# EAGLE schematic cigpack-main rc1a (EAGLE 4.13)
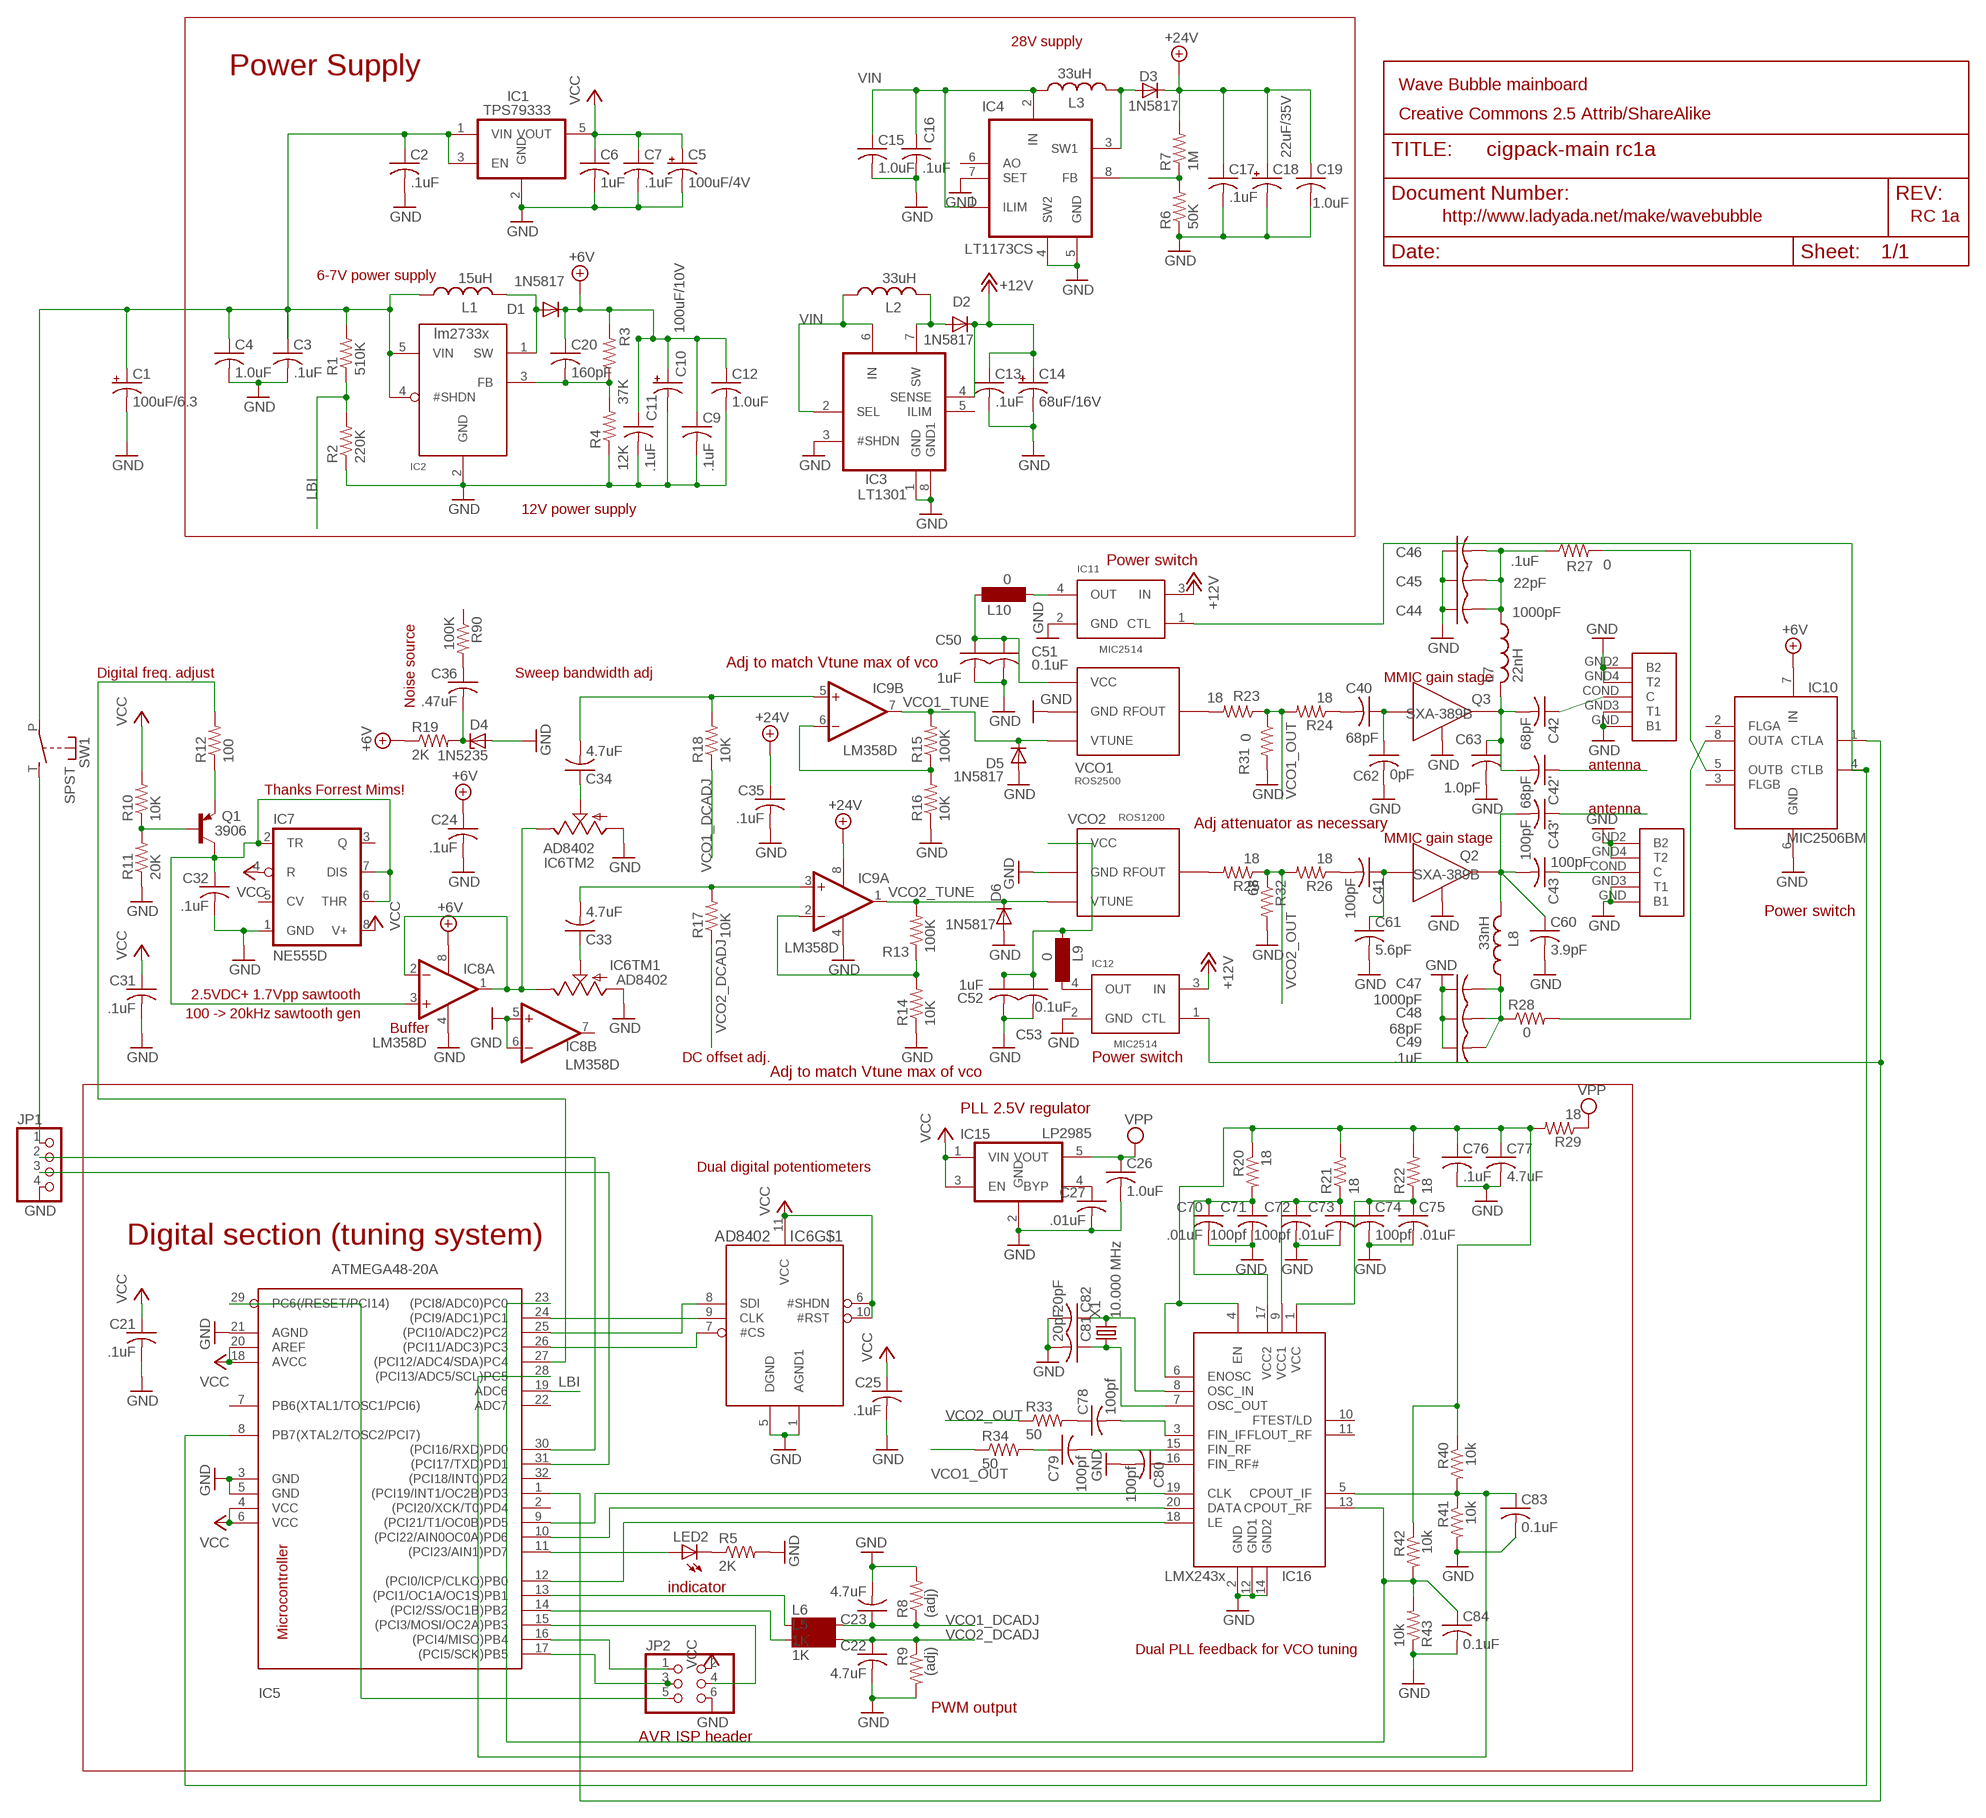
[diagram p0: schematic, sheet 1]

## Parts
C1  100uF/6.3  CPOL-USD  [PANASONIC_D]
C2  .1uF  C-USC1206  [C1206]
C3  .1uF  C-USC1206  [C1206]
C4  1.0uF  C-USC1206  [C1206]
C5  100uF/4V  CPOL-USD  [PANASONIC_D]
C6  1uF  C-USC1206  [C1206]
C7  .1uF  C-USC1206  [C1206]
C9  .1uF  C-USC1206  [C1206]
C10  100uF/10V  CPOL-USCT7343  [CT7343]
C11  .1uF  C-USC1206  [C1206]
C12  1.0uF  C-USC1206  [C1206]
C13  .1uF  C-USC1206  [C1206]
C14  68uF/16V  CPOL-USCT6032  [CT6032]
C15  1.0uF  C-USC1206  [C1206]
C16  .1uF  C-USC1206  [C1206]
C17  .1uF  C-USC1206  [C1206]
C18  22uF/35V  CPOL-USD/7343-31W  [D/7343-31W]
C19  1.0uF  C-USC1206  [C1206]
C20  160pF  C-USC1206  [C1206]
C21  .1uF  C-USC1206  [C1206]
C22  4.7uF  C-USC1206  [C1206]
C23  4.7uF  C-USC1206  [C1206]
C24  .1uF  C-USC1206  [C1206]
C25  .1uF  C-USC1206  [C1206]
C26  1.0uF  C-USC1206  [C1206]
C27  .01uF  C-USC0603  [C0603]
C31  .1uF  C-USC0603  [C0603]
C32  .1uF  C-USC1206  [C1206]
C33  4.7uF  C-USC1206  [C1206]
C34  4.7uF  C-USC1206  [C1206]
C35  .1uF  C-USC1206  [C1206]
C36  .47uF  C-USC1206  [C1206]
C40  68pF  C-USC0603  [C0603]
C41  100pF  C-USC0603  [C0603]
C42  68pF  C-USC0603  [C0603]
C42'  68pF  C-USC0603  [C0603]
C43  100pF  C-USC0603  [C0603]
C43'  100pF  C-USC0603  [C0603]
C44  1000pF  C-USC0603  [C0603]
C45  22pF  C-USC0603  [C0603]
C46  .1uF  C-USC1206  [C1206]
C47  1000pF  C-USC0603  [C0603]
C48  68pF  C-USC0603  [C0603]
C49  .1uF  C-USC1206  [C1206]
C50  1uF  C-USC1206  [C1206]
C51  0.1uF  C-USC1206  [C1206]
C52  1uF  C-USC1206  [C1206]
C53  0.1uF  C-USC1206  [C1206]
C60  3.9pF  C-USC0603  [C0603]
C61  5.6pF  C-USC0603  [C0603]
C62  0pF  C-USC0603  [C0603]
C63  1.0pF  C-USC0603  [C0603]
C70  .01uF  C-USC0603  [C0603]
C71  100pf  C-USC0603  [C0603]
C72  100pf  C-USC0603  [C0603]
C73  .01uF  C-USC0603  [C0603]
C74  100pf  C-USC0603  [C0603]
C75  .01uF  C-USC0603  [C0603]
C76  .1uF  C-USC0603  [C0603]
C77  4.7uF  C-USC0603  [C0603]
C78  100pf  C-USC0603  [C0603]
C79  100pf  C-USC0603  [C0603]
C80  100pf  C-USC0603  [C0603]
C81  20pF  C-USC0603  [C0603]
C82  20pF  C-USC0603  [C0603]
C83  0.1uF  C-USC1206  [C1206]
C84  0.1uF  C-USC1206  [C1206]
D1  1N5817  DIODE-SMB  [SMB]
D2  1N5817  DIODE-SMB  [SMB]
D3  1N5817  DIODE-SMB  [SMB]
D4  1N5235  ZENER-DIODESMB  [SMB]
D5  1N5817  DIODE-SMB  [SMB]
D6  1N5817  DIODE-SMB  [SMB]
IC1  TPS79333  TPS79XXX  [SOT23-5L]
IC2  LM2733  [SOT23-5L]
IC3  LT1301  [SO08]
IC4  LT1173CS  [SO08]
IC5  ATMEGA48-20A  [TQFP32-08]
IC6  AD8402  [SO14]
IC7  NE555D  [SO08]
IC8  LM358D  [SO08]
IC9  LM358D  [SO08]
IC10  MIC2506BM  [SO08]
IC11  MIC2514  [SOT23-5L]
IC12  MIC2514  [SOT23-5L]
IC15  LP2985  [SOT23-5L]
IC16  LMX243X  [TSSOP-20]
JP1  PINHD-1X4  [1X04]
JP2  PINHD-2X3  [2X03]
L1  15uH  L_CDRH  [CDRH6D28]
L2  33uH  L_CDRH  [CDRH6D28]
L3  33uH  L_CDRH  [CDRH6D28]
L5  1K  SM-1206  [SM-1206]
L6  1K  SM-1206  [SM-1206]
L7  22nH  L_0603  [0603]
L8  33nH  L_0603  [0603]
L9  0  SM-1206  [SM-1206]
L10  0  SM-1206  [SM-1206]
LED2  LEDCHIPLED_1206  [CHIPLED_1206]
Q1  3906  MMBT3906LT1SMD  [SOT23-BEC]
Q2  SXA-389B  MMIC_MIDPOWERGAIN  [SOT89]
Q3  SXA-389B  MMIC_MIDPOWERGAIN  [SOT89]
R1  510K  R-US_R1206  [R1206]
R2  220K  R-US_R1206  [R1206]
R3  37K  R-US_R1206  [R1206]
R4  12K  R-US_R1206  [R1206]
R5  2K  R-US_R1206  [R1206]
R6  50K  R-US_R1206  [R1206]
R7  1M  R-US_R1206  [R1206]
R8  (adj)  R-US_R1206  [R1206]
R9  (adj)  R-US_R1206  [R1206]
R10  10K  R-US_R1206  [R1206]
R11  20K  R-US_R1206  [R1206]
R12  100  R-US_R1206  [R1206]
R13  100K  R-US_R1206  [R1206]
R14  10K  R-US_R1206  [R1206]
R15  100K  R-US_R1206  [R1206]
R16  10K  R-US_R1206  [R1206]
R17  10K  R-US_R1206  [R1206]
R18  10K  R-US_R1206  [R1206]
R19  2K  R-US_R1206  [R1206]
R20  18  R-US_R0603  [R0603]
R21  18  R-US_R0603  [R0603]
R22  18  R-US_R0603  [R0603]
R23  18  R-US_R0603  [R0603]
R24  18  R-US_R0603  [R0603]
R25  18  R-US_R0603  [R0603]
R26  18  R-US_R0603  [R0603]
R27  0  R-US_M1206  [M1206]
R28  0  R-US_M1206  [M1206]
R29  18  R-US_R0603  [R0603]
R31  0  R-US_R0603  [R0603]
R32  68  R-US_R0603  [R0603]
R33  50  R-US_R0603  [R0603]
R34  50  R-US_R0603  [R0603]
R40  10k  R-US_R0603  [R0603]
R41  10k  R-US_R1206  [R1206]
R42  10k  R-US_R0603  [R0603]
R43  10k  R-US_R1206  [R1206]
R90  100K  R-US_R1206  [R1206]
SW1  SPST  [JUDCOSPST]
U$8  SMAANTENNA  [SMA-ANTENNA]
U$9  SMAANTENNA  [SMA-ANTENNA]
VCO1  ROS2500  VCOKG  [MINICIRCUITS_KG]
VCO2  ROS1200  VCOKG  [MINICIRCUITS_KG]
X1  10.000 MHz  CRYSTAL_CRYTALABMM  [ABMM]

## Nets
+6V: C9.1 C10.+ C11.1 C12.1 C20.1 C24.1 D1.C IC8.8(P:V+) IC10.7(IN) R3.2 R19.1
+12V: C13.1 C14.+ D2.C IC3.4(SENSE) IC11.3(IN) IC12.3(IN)
+24V: C17.1 C18.+ C19.1 C35.1 D3.C IC9.8(P:V+) R7.2
CLK: IC5.24((PCI9/ADC1)PC1) IC6.9(CLK)
CP_IF: C83.1 IC5.28((PCI13/ADC5/SCL)PC5) IC16.5(CPOUT_IF) R40.2 R41.1
CP_RF: C84.1 IC5.23((PCI8/ADC0)PC0) IC16.13(CPOUT_RF) R42.2 R43.2
FB: IC4.8(FB) R6.2 R7.1
GND: C1.- C2.2 C3.2 C4.2 C5.- C6.2 C7.2 C9.2 C10.- C11.2 C12.2 C13.2 C14.- C15.2 C16.2 C17.2 C18.- C19.2 C21.2 C22.2 C23.2 C24.2 C25.2 C26.2 C27.2 C31.2 C32.2 C35.2 C44.1 C45.1 C46.1 C47.1 C48.1 C49.1 C50.2 C51.2 C52.2 C53.2 C60.2 C61.2 C62.2 C63.2 C70.2 C71.2 C72.2 C73.2 C74.2 C75.2 C76.2 C77.2 C80.2 C81.2 C82.2 C83.2 C84.2 D4.A D5.A D6.A IC1.2(GND) IC2.2(GND) IC3.1(GND) IC3.3(#SHDN) IC3.8(GND1) IC4.4(SW2) IC4.5(GND) IC4.7(SET) IC5.3(GND) IC5.5(GND) IC5.21(AGND) IC6.1(AGND1) IC6.2(TM2:B) IC6.5(DGND) IC6.14(TM1:B) IC7.1(GND) IC8.4(P:V-) IC8.5(B:+IN) IC8.6(B:-IN) IC9.4(P:V-) IC10.6(GND) IC11.2(GND) IC12.2(GND) IC15.2(GND) IC16.2(GND) IC16.12(GND1) IC16.14(GND2) JP1.4 JP2.6 Q2.2(GND) Q3.2(GND) R2.1 R4.1 R5.2 R6.1 R8.2 R9.2 R11.1 R14.1 R16.1 R31.2 R32.2 R41.2 R43.1 U$8.GND2(B2) U$8.GND3(T1) U$8.GND4(T2) U$8.GND(B1) U$9.GND2(B2) U$9.GND3(T1) U$9.GND4(T2) U$9.GND(B1) VCO1.P$1(GND) VCO2.P$1(GND)
LBI: IC5.19(ADC6) R1.1 R2.2
MISO: IC5.16((PCI4/MISO)PB4) JP2.1
N$1: IC5.26((PCI11/ADC3)PC3) IC6.7(#CS)
N$2: D1.A IC2.1(SW) L1.L2
N$3: IC5.11((PCI23/AIN1)PD7) LED2.A
N$5: C36.2 D4.C R19.2
N$6: C78.1 R33.2
N$7: IC5.14((PCI2/SS/OC1B)PB2) L5.1
N$8: IC5.1((PCI19/INT1/OC2B)PD3) IC10.1(CTLA) IC12.1(CTL)
N$9: IC5.13((PCI1/OC1A/OC1S)PB1) L6.1
N$10: D2.A IC3.7(SW) L2.L2
N$11: Q1.B R10.1 R11.2
N$12: C32.1 IC7.2(TR) IC7.6(THR) IC7.7(DIS) IC8.3(A:+IN) Q1.C
N$13: Q1.E R12.1
N$14: C41.1 C61.1 Q2.1(RF_IN)
N$15: IC6.3(TM2:A) IC6.13(TM1:A) IC8.1(A:OUT) IC8.2(A:-IN)
N$16: C33.2 IC9.3(A:+IN) R17.2
N$17: C40.1 C62.1 Q3.1(RF_IN)
N$18: IC9.2(A:-IN) R13.1 R14.2
N$19: D3.A IC4.3(SW1) L3.L2
N$20: IC5.17((PCI5/SCK)PB5) JP2.3
N$21: C33.1 IC6.12(TM1:W)
N$22: IC9.6(B:-IN) R15.1 R16.2
N$23: IC11.4(OUT) L10.1
N$24: C34.1 IC6.4(TM2:W)
N$25: C79.1 R34.2
N$26: C44.2 C45.2 C46.2 L7.1 R27.1
N$27: IC10.8(OUTA) R28.2
N$28: C34.2 IC9.5(B:+IN) R18.2
N$29: C50.1 C51.1 L10.2 VCO1.P$14(VCC)
N$30: C52.1 C53.1 L9.1 VCO2.P$14(VCC)
N$31: C36.1 R90.2
N$32: C47.2 C48.2 C49.2 L8.1 R28.1
N$33: IC12.4(OUT) L9.2
N$34: IC5.15((PCI3/MOSI/OC2A)PB3) JP2.4
N$35: C82.1 IC16.8(OSC_IN) X1.X2
N$35R: C43'.2 C43.2 C60.1 L8.2 Q2.3(OUT)
N$37: C80.1 IC16.16(FIN_RF#)
N$39: C27.1 IC15.4(BYP)
N$40: C76.1 C77.1 IC16.4(EN) IC16.6(ENOSC) R20.1 R21.2 R22.2 R29.2 R40.1 R42.1
N$41: R23.2 VCO1.P$10(RFOUT)
N$42: C40.2 R24.1
N$43: C42'.2 C42.2 C63.1 L7.2 Q3.3(OUT)
N$45: IC5.27((PCI12/ADC4/SDA)PC4) R12.2
N$46: C78.2 IC16.3(FIN_IF)
N$47: R25.2 VCO2.P$10(RFOUT)
N$49: C41.2 R26.1
N$52: C79.2 IC16.15(FIN_RF)
N$57: JP1.1 SW1.T(S)
N$58: IC10.5(OUTB) R27.2
N$60: LED2.C R5.1
N$664: IC5.8(PB7(XTAL2/TOSC2/PCI7)) IC10.4(CTLB) IC11.1(CTL)
N$666: C81.1 IC16.7(OSC_OUT) X1.X1
N$10077: C74.1 C75.1 IC16.1(VCC) R22.1
PLL_CLK: IC5.9((PCI21/T1/OC0B)PD5) IC16.19(CLK)
PLL_DATA: IC5.10((PCI22/AIN0OC0A)PD6) IC16.20(DATA)
PLL_LE: IC5.12((PCI0/ICP/CLKO)PB0) IC16.18(LE)
RESET: IC5.29(PC6(/RESET/PCI14)) JP2.5
RF_OUT: C43.1 U$8.COND(C)
RF_OUT1: C42.1 U$9.COND(C)
RX: IC5.30((PCI16/RXD)PD0) JP1.2
SDI: IC5.25((PCI10/ADC2)PC2) IC6.8(SDI)
SENSE: C20.2 IC2.3(FB) R3.1 R4.2
STRIPLINE1: C42'.1
STRIPLINE2: C43'.1
TX: IC5.31((PCI17/TXD)PD1) JP1.3
VCC: C5.+ C6.1 C7.1 C21.1 C25.1 C31.1 IC1.5(VOUT) IC5.4(VCC) IC5.6(VCC) IC5.18(AVCC) IC5.20(AREF) IC6.6(#SHDN) IC6.10(#RST) IC6.11(VCC) IC7.4(R) IC7.8(V+) IC15.1(VIN) IC15.3(EN) JP2.2 R10.2
VCC1: C72.1 C73.1 IC16.9(VCC1) R21.1
VCC2: C70.1 C71.1 IC16.17(VCC2) R20.2
VCO1_DCADJ: C23.1 L6.2 R8.1 R18.1
VCO1_OUT: R23.1 R24.2 R31.1 R34.1
VCO1_TUNE: D5.C IC9.7(B:OUT) R15.2 VCO1.P$2(VTUNE)
VCO2_DCADJ: C22.1 L5.2 R9.1 R17.1
VCO2_OUT: R25.1 R26.2 R32.1 R33.1
VCO2_TUNE: D6.C IC9.1(A:OUT) R13.2 VCO2.P$2(VTUNE)
VIN: C1.+ C2.1 C3.1 C4.1 C15.1 C16.1 IC1.1(VIN) IC1.3(EN) IC2.4(#SHDN) IC2.5(VIN) IC3.2(SEL) IC3.6(IN) IC4.1(ILIM) IC4.2(IN) L1.L1 L2.L1 L3.L1 R1.2 SW1.P
VPP: C26.1 IC15.5(VOUT) R29.1
Unconnected: IC3.5(ILIM) IC4.6(AO) IC5.2((PCI20/XCK/T0)PD4) IC5.7(PB6(XTAL1/TOSC1/PCI6)) IC5.22(ADC7) IC5.32((PCI18/INT0)PD2) IC7.3(Q) IC7.5(CV) IC8.7(B:OUT) IC10.2(FLGA) IC10.3(FLGB) IC16.10(FTEST/LD) IC16.11(FLOUT_RF) R90.1

## Notes on the sheet
- 28V supply
- Power Supply
- Wave Bubble mainboard
- Creative Commons 2.5 Attrib/ShareAlike
- http://www.ladyada.net/make/wavebubble | RC 1a
- 6-7V power supply
- 12V power supply
- Power switch
- Noise source
- Digital freq. adjust | Sweep bandwidth adj | Adj to match Vtune max of vco
- MMIC gain stage
- antenna
- Thanks Forrest Mims!
- antenna
- Adj attenuator as necessary
- MMIC gain stage
- Power switch
- 2.5VDC+ 1.7Vpp sawtooth
- 100 -> 20kHz sawtooth gen
- Buffer
- DC offset adj. | Power switch
- Adj to match Vtune max of vco
- PLL 2.5V regulator
- Dual digital potentiometers
- Digital section (tuning system)
- indicator
- Microcontroller
- Dual PLL feedback for VCO tuning
- PWM output
- AVR ISP header

## Library data of the parts
C1 C5 C10 C14 C18 = rcl:CPOL-US: POLARIZED CAPACITOR, American symbol
C2-C4 C6 C7 C9 C11-C13 C15-C17 C19-C27 C31-C36 C40-C42 C42' C43 C43' C44-C53 C60-C63 C70-C84 = rcl:C-US: CAPACITOR, American symbol
D1-D3 D5 D6 = diode:DIODE-: DIODE
D4 = diode:ZENER-DIODE: Z-Diode
IC1 = cleanair:TPS79XXX
IC2 = cleanair:LM2733
IC3 = cleanair:LT1301
IC4 = cleanair:LT1173
IC5 = avr:ATMEGA48: MICROCONTROLLER 4 Kbytes FLASH 512 Bytes SRAM 256 Bytes EEPROM USART 8-channel 10 bit ADC
IC6 = cleanair:AD8402
IC7 = linear:*555: TIMER
IC8 IC9 = linear:LM358: OP AMP
IC10 = cleanair:MIC2506
IC11 IC12 = cleanair:MIC2514
IC15 = cleanair:LP2985
IC16 = cleanair:LMX243X
JP1 = pinhead:PINHD-1X4: PIN HEADER
JP2 = pinhead:PINHD-2X3: PIN HEADER
L1-L3 = cleanair:L
L5 L6 L9 L10 = inductor-neosid:SM-1206: INDUCTOR SMD chip inductor
L7 L8 = cleanair:L_0603
LED2 = led:LED: LED OSRAM: - CHIPLED LG R971, LG N971, LY N971, LG Q971, LY Q971, LO R971, LY R971 LH N974, LH R974 LS Q976, LO Q976, LY Q976 LO Q996 - Hyper CHIPLED LW Q18S LB Q993, LB Q99A, LB R99A - SideLED LS A670, LO A670, LY A670, LG A670, LP A670 LB A673, LV A673, LT A673, LW A673 LH A674 LY A675 LS A676, LA A676, LO A676, LY A676, LW A676 LS A679, LY A679, LG A679 - Hyper Micro SIDELED® LS Y876, LA Y876, LO Y876, LY Y876 LT Y87S - SmartLED LW L88C, LW L88S LB L89C, LB L89S, LG L890 LS L89K, LO L89K, LY L89K LS L896, LA L896, LO L896, LY L896 - TOPLED LS T670, LO T670, LY T670, LG T670, LP T670 LSG T670, LSP T670, LSY T670, LOP T670, LYG T670 LG T671, LOG T671, LSG T671 LB T673, LV T673, LT T673, LW T673 LH T674 LS T676, LA T676, LO T676, LY T676, LB T676, LH T676, LSB T676, LW T676 LB T67C, LV T67C, LT T67C, LS T67K, LO T67K, LY T67K, LW E67C LS E67B, LA E67B, LO E67B, LY E67B, LB E67C, LV E67C, LT E67C LW T67C LS T679, LY T679, LG T679 LS T770, LO T770, LY T770, LG T770, LP T770 LB T773, LV T773, LT T773, LW T773 LH T774 LS E675, LA E675, LY E675, LS T675 LS T776, LA T776, LO T776, LY T776, LB T776 LHGB T686 LT T68C, LB T68C - Hyper Mini TOPLED® LB M676 - Mini TOPLED Santana® LG M470 LS M47K, LO M47K, LY M47K Source: http://www.osram.convergy.de/
Q1 = transistor-pnp:MMBT3906*: PNP Transistror
Q2 Q3 = cleanair:MMIC_MIDPOWERGAIN
R1-R29 R31-R34 R40-R43 R90 = rcl:R-US_: RESISTOR, American symbol
SW1 = cigpack-main_rc1:SPST
U$8 U$9 = cleanair:SMA
VCO1 VCO2 = cleanair:VCO
X1 = cigpack-main_rc1:CRYSTAL_CRYTAL: CRYSTAL